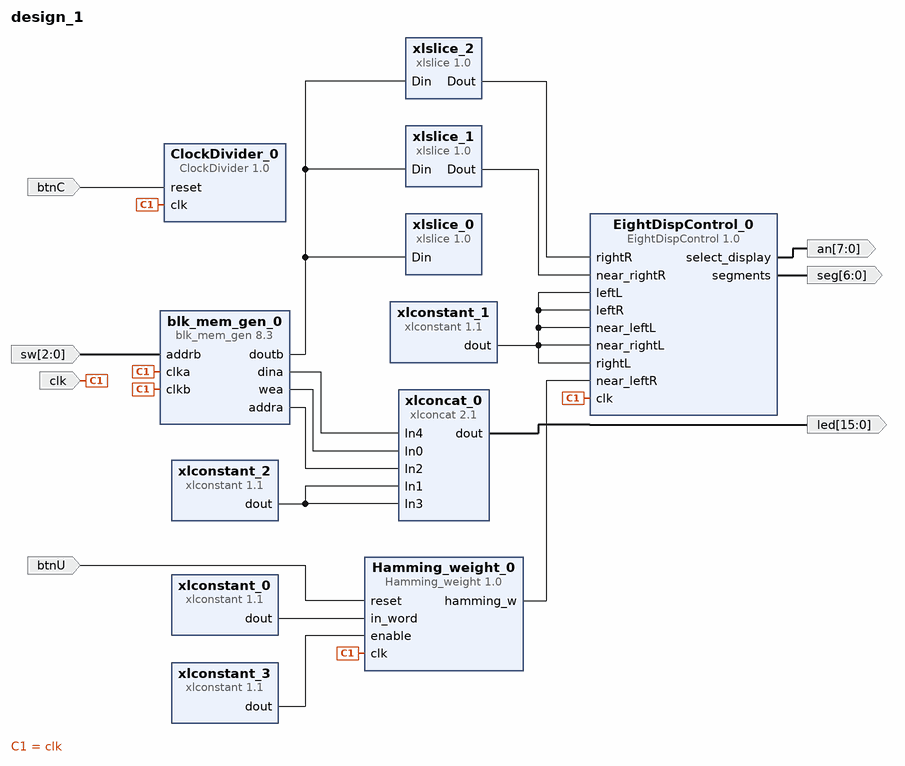
[diagram p0: block diagram of the top level]
# Vivado block design design_1, xc7a100tcsg324-1, Vivado 2016.4
create_bd_design design_1

create_bd_port -dir O -from 7 -to 0 an
create_bd_port -dir O -from 6 -to 0 seg
create_bd_port -dir I -from 2 -to 0 sw
create_bd_port -dir I btnU
create_bd_port -dir I clk
create_bd_port -dir I btnC
create_bd_port -dir O -from 15 -to 0 led

create_bd_cell -type ip -vlnv ua.pt:user:EightDispControl:1.0 EightDispControl_0
create_bd_cell -type ip -vlnv xilinx.com:ip:xlslice:1.0 xlslice_0
set_property -dict {CONFIG.DOUT_WIDTH 2 CONFIG.DIN_TO 8 CONFIG.DIN_FROM 9 CONFIG.DIN_WIDTH 10} [get_bd_cells xlslice_0]
create_bd_cell -type ip -vlnv xilinx.com:ip:xlslice:1.0 xlslice_1
set_property -dict {CONFIG.DOUT_WIDTH 4 CONFIG.DIN_TO 4 CONFIG.DIN_FROM 7 CONFIG.DIN_WIDTH 10} [get_bd_cells xlslice_1]
create_bd_cell -type ip -vlnv xilinx.com:ip:xlslice:1.0 xlslice_2
set_property -dict {CONFIG.DOUT_WIDTH 4 CONFIG.DIN_TO 0 CONFIG.DIN_FROM 3 CONFIG.DIN_WIDTH 10} [get_bd_cells xlslice_2]
create_bd_cell -type ip -vlnv xilinx.com:ip:xlconstant:1.1 xlconstant_0
set_property -dict {CONFIG.CONST_WIDTH 10 CONFIG.CONST_VAL 240} [get_bd_cells xlconstant_0]
create_bd_cell -type ip -vlnv xilinx.com:ip:xlconstant:1.1 xlconstant_1
set_property -dict {CONFIG.CONST_WIDTH 4 CONFIG.CONST_VAL 0} [get_bd_cells xlconstant_1]
create_bd_cell -type ip -vlnv xilinx.com:ip:blk_mem_gen:8.3 blk_mem_gen_0
set_property -dict [list \
  CONFIG.Memory_Type Simple_Dual_Port_RAM \
  CONFIG.Enable_32bit_Address false \
  CONFIG.Use_Byte_Write_Enable false \
  CONFIG.Write_Width_A 10 \
  CONFIG.Operating_Mode_A NO_CHANGE \
  CONFIG.Enable_A Always_Enabled \
  CONFIG.Write_Width_B 10 \
  CONFIG.Read_Width_B 10 \
  CONFIG.Enable_B Always_Enabled \
  CONFIG.Register_PortB_Output_of_Memory_Primitives false \
  CONFIG.Register_PortB_Output_of_Memory_Core false \
  CONFIG.Fill_Remaining_Memory_Locations false \
  CONFIG.Use_RSTB_Pin false \
  CONFIG.Port_A_Write_Rate 50 \
  CONFIG.Port_B_Clock 100 \
  CONFIG.Port_B_Enable_Rate 100 \
  CONFIG.use_bram_block Stand_Alone \
] [get_bd_cells blk_mem_gen_0]
create_bd_cell -type ip -vlnv xilinx.com:user:ClockDivider:1.0 ClockDivider_0
set_property -dict {CONFIG.division_bits 26} [get_bd_cells ClockDivider_0]
create_bd_cell -type ip -vlnv xilinx.com:ip:xlconcat:2.1 xlconcat_0
set_property -dict {CONFIG.NUM_PORTS 5} [get_bd_cells xlconcat_0]
create_bd_cell -type ip -vlnv xilinx.com:ip:xlconstant:1.1 xlconstant_2
set_property -dict {CONFIG.CONST_VAL 0} [get_bd_cells xlconstant_2]
create_bd_cell -type ip -vlnv xilinx.com:user:Hamming_weight:1.0 Hamming_weight_0
create_bd_cell -type ip -vlnv xilinx.com:ip:xlconstant:1.1 xlconstant_3

# ---- connections ----

connect_bd_net [get_bd_pins EightDispControl_0/select_display] [get_bd_ports an]
connect_bd_net [get_bd_pins EightDispControl_0/segments] [get_bd_ports seg]
connect_bd_net [get_bd_pins xlslice_2/Dout] [get_bd_pins EightDispControl_0/rightR]
connect_bd_net [get_bd_pins xlslice_1/Dout] [get_bd_pins EightDispControl_0/near_rightR]
connect_bd_net [get_bd_pins xlconstant_1/dout] \
  [get_bd_pins EightDispControl_0/leftL] [get_bd_pins EightDispControl_0/near_leftL] \
  [get_bd_pins EightDispControl_0/near_rightL] [get_bd_pins EightDispControl_0/rightL] [get_bd_pins EightDispControl_0/leftR]
connect_bd_net -net Convert_10_8_to_8_10_FSM_0_out_word [get_bd_pins blk_mem_gen_0/dina] [get_bd_pins xlconcat_0/In4]
connect_bd_net -net Convert_10_8_to_8_10_FSM_0_ready [get_bd_pins blk_mem_gen_0/wea] [get_bd_pins xlconcat_0/In0]
connect_bd_net [get_bd_ports sw] [get_bd_pins blk_mem_gen_0/addrb]
connect_bd_net -net Convert_10_8_to_8_10_FSM_0_write_address [get_bd_pins blk_mem_gen_0/addra] [get_bd_pins xlconcat_0/In2]
connect_bd_net [get_bd_pins blk_mem_gen_0/doutb] [get_bd_pins xlslice_2/Din] [get_bd_pins xlslice_1/Din] [get_bd_pins xlslice_0/Din]
connect_bd_net [get_bd_ports clk] \
  [get_bd_pins blk_mem_gen_0/clka] [get_bd_pins EightDispControl_0/clk] [get_bd_pins ClockDivider_0/clk] \
  [get_bd_pins blk_mem_gen_0/clkb] [get_bd_pins Hamming_weight_0/clk]
connect_bd_net [get_bd_ports btnC] [get_bd_pins ClockDivider_0/reset]
connect_bd_net [get_bd_pins xlconstant_2/dout] [get_bd_pins xlconcat_0/In1] [get_bd_pins xlconcat_0/In3]
connect_bd_net [get_bd_pins xlconcat_0/dout] [get_bd_ports led]
connect_bd_net [get_bd_ports btnU] [get_bd_pins Hamming_weight_0/reset]
connect_bd_net [get_bd_pins xlconstant_0/dout] [get_bd_pins Hamming_weight_0/in_word]
connect_bd_net [get_bd_pins xlconstant_3/dout] [get_bd_pins Hamming_weight_0/enable]
connect_bd_net [get_bd_pins Hamming_weight_0/hamming_w] [get_bd_pins EightDispControl_0/near_leftR]

validate_bd_design
save_bd_design
